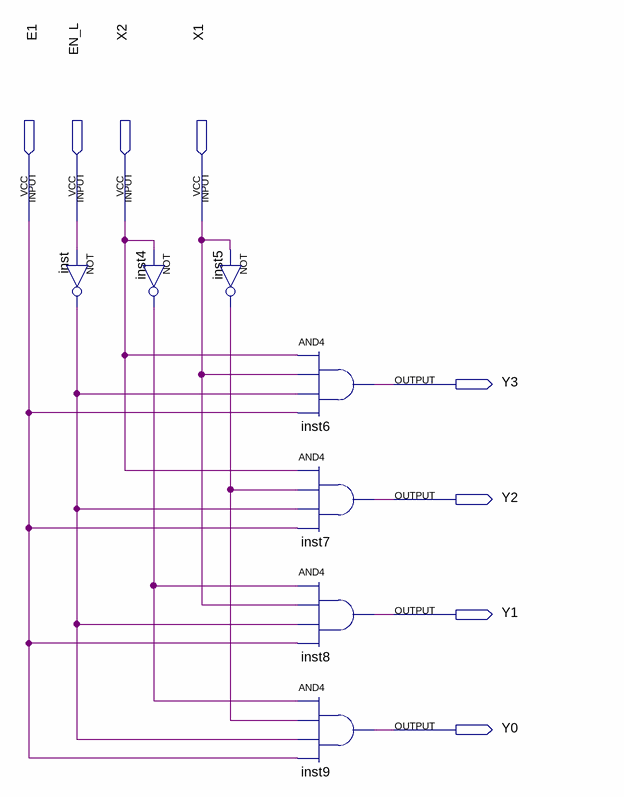
[diagram p0: schematic sheet]
// Quartus schematic Dec2_4.bdf as structural Verilog: 7 symbols, 8 pins
module Dec2_4 (
  input  E1,
  input  EN_L,
  input  X2,
  input  X1,
  output Y3,
  output Y2,
  output Y1,
  output Y0
);

  wire inst4_out, inst5_out, inst_out;

  not inst (inst_out, EN_L);
  not inst4 (inst4_out, X2);
  not inst5 (inst5_out, X1);
  and inst6 (Y3, X2, X1, inst_out, E1);
  and inst7 (Y2, X2, inst5_out, inst_out, E1);
  and inst8 (Y1, inst4_out, X1, inst_out, E1);
  and inst9 (Y0, inst4_out, inst5_out, inst_out, E1);
endmodule
